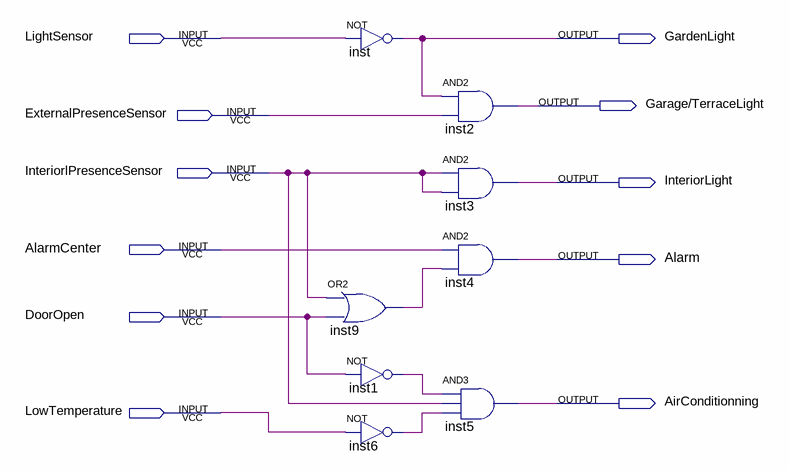
[diagram p0: schematic sheet]
// Quartus schematic Automation.bdf as structural Verilog: 8 symbols, 11 pins
module Automation (
  input  LightSensor,
  input  ExternalPresenceSensor,
  input  InteriorlPresenceSensor,
  input  AlarmCenter,
  input  DoorOpen,
  input  LowTemperature,
  output GardenLight,
  output \Garage/TerraceLight ,
  output InteriorLight,
  output Alarm,
  output AirConditionning
);

  wire inst1_out, inst6_out, inst9_out;

  or inst9 (inst9_out, InteriorlPresenceSensor, DoorOpen);
  not inst (GardenLight, LightSensor);
  not inst1 (inst1_out, DoorOpen);
  not inst6 (inst6_out, LowTemperature);
  and inst2 (\Garage/TerraceLight , GardenLight, ExternalPresenceSensor);
  and inst3 (InteriorLight, InteriorlPresenceSensor, InteriorlPresenceSensor);
  and inst4 (Alarm, AlarmCenter, inst9_out);
  and inst5 (AirConditionning, inst1_out, InteriorlPresenceSensor, inst6_out);
endmodule
